# Altium project Face_detectionMac.PrjPCB
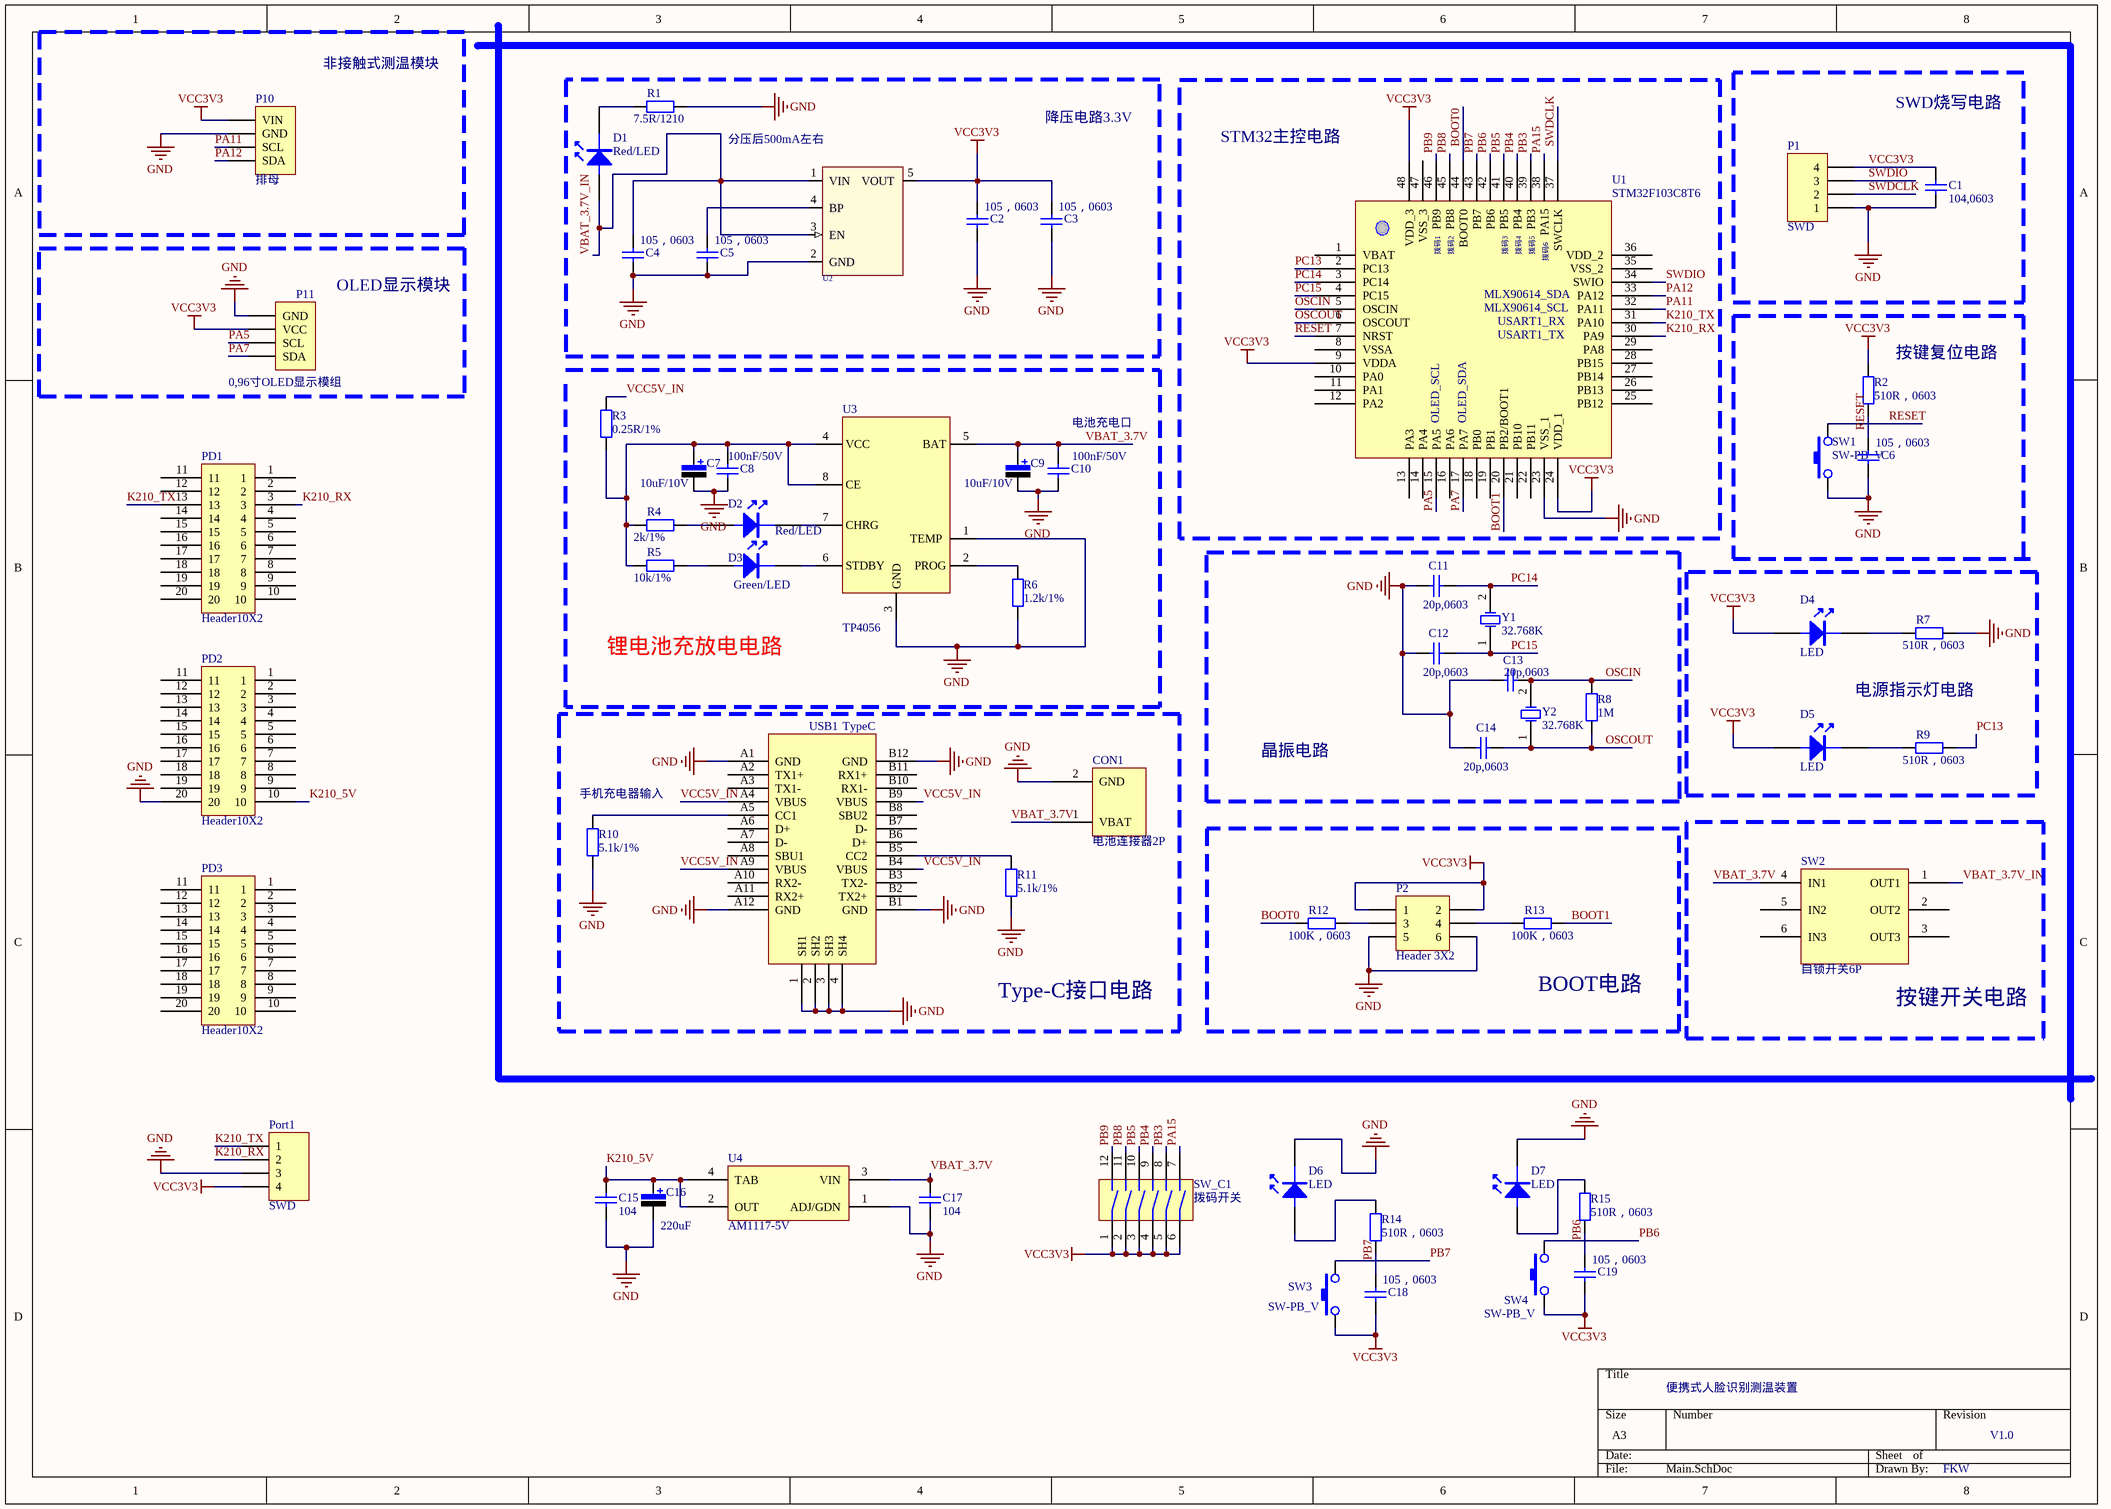
[diagram p0: Main.SchDoc]
1 sheet, 62 parts. Net scope: global (net labels, ports and power ports of the same name join across sheets).
Board file: 便携式人脸识别PCB图.PcbDoc

## Sheet Main.SchDoc
size A3

### Parts
C1  104,0603  [C0603]
C2  105，0603  [C0603]
C3  105，0603  [C0603]
C4  105，0603  [C0603]
C5  105，0603  [C0603]
C6  105，0603  [C0603]
C7  10uF/10V  [C0805tan]
C8  100nF/50V  [C0603]
C9  10uF/10V  [C0805tan]
C10  100nF/50V  [C0603]
C11  20p,0603  [C0603]
C12  20p,0603  [C0603]
C13  20p,0603  [C0603]
C14  20p,0603  [C0603]
C15  104  [C0603]
C16  220uF  [C0805tan]
C17  104  [C0603]
C18  105，0603  [C0603]
C19  105，0603  [C0603]
CON1  电池连接器2P  [CONN-TH_DF1B-2P-2.5DSA-01]
D1  Red/LED  [LED]
D2  Red/LED  [LED]
D3  Green/LED  [LED]
D4  LED  [LED]
D5  LED  [LED]
D6  LED  [LED]
D7  LED  [LED]
P1  SWD  [HDR1X4H]
P2  Header 3X2  [HDR2X3]
P10  排母  [HRD1X4]
P11  0,96寸OLED显示模组  [0.96寸OLED显示模组]
PD1  Header10X2  [header2X10]
PD2  Header10X2  [header2X10]
PD3  Header10X2  [header2X10]
Port1  SWD  [HDR1X4H]
R1  7.5R/1210  [R0603]
R2  510R，0603  [R0603]
R3  0.25R/1%  [R0603]
R4  2k/1%  [R0603]
R5  10k/1%  [R0603]
R6  1.2k/1%  [R0603]
R7  510R，0603  [R0603]
R8  1M  [R0603]
R9  510R，0603  [R0603]
R10  5.1k/1%  [R0603]
R11  5.1k/1%  [R0603]
R12  100K，0603  [R0603]
R13  100K，0603  [R0603]
R14  510R，0603  [R0603]
R15  510R，0603  [R0603]
SW1  SW-PB_V  [轻触开关_TPR_SMD]
SW2  自锁开关6P  [SW_自锁]
SW3  SW-PB_V  [轻触开关_TPR_SMD]
SW4  SW-PB_V  [轻触开关_TPR_SMD]
SW_C1  拨码开关  [6P拨码开关]
U1  STM32F103C8T6  [48P]
U2  RT9193  [SOT-23-5]  (value not drawn)
U3  TP4056  [SOP8-TP4056-3D]
U4  AM1117-5V  [AM1117-5V-SOT-223]
USB1  TypeC  [Type-c]
Y1  32.768K  [SMD2012]
Y2  32.768K  [XTAL1]

### Blocks framed on the sheet
非接触式测温模块: P10
降压电路3.3V: C2-C5 D1 R1 U2
STM32主控电路: U1
SWD烧写电路: C1 P1
OLED显示模块: P11
晶振电路: C11-C14 R8 Y1 Y2
Type-C接口电路: CON1 R10 R11 USB1
按键开关电路: SW2
BOOT电路: P2 R12 R13

### Nets
GND: C1.1 C2.1 C3.1 C4.1 C5.1 C6.1 C7.2 C8.1 C9.2 C10.1 C11.1 C12.1 C13.1 C14.1 C15.1 C16.2 C17.1 CON1.2(GND) D6.K D7.K P1.1 P2.5 P2.6 P10.2(GND) P11.1(GND) PD2.20 Port1.3 R1.1 R6.2 R7.1 R10.2 R11.2 SW1.1 U1.23(VSS_1) U2.2(GND) U3.1(TEMP) U3.3(GND) U4.1(ADJ/GDN) USB1.1(SH1) USB1.2(SH2) USB1.3(SH3) USB1.4(SH4) USB1.A1(GND) USB1.A12(GND) USB1.B1(GND) USB1.B12(GND)
VCC3V3: C1.2 C2.2 C3.2 C18.1 C19.1 D4.A D5.A P1.4 P2.1 P2.2 P10.1(VIN) P11.2(VCC) Port1.4 R2.2 SW3.1 SW4.1 SW_C1.1 SW_C1.2 SW_C1.3 SW_C1.4 SW_C1.5 SW_C1.6 U1.9(VDDA) U1.24(VDD_1) U1.48(VDD_3) U2.5(VOUT)
BOOT0: R12.2 U1.44(BOOT0)
BOOT1: R13.1 U1.20(PB2/BOOT1)
K210_5V: C15.2 C16.1 PD2.10 U4.2(OUT) U4.4(TAB)
K210_RX: PD1.3 Port1.2 U1.30(PA9)
K210_TX: PD1.13 Port1.1 U1.31(PA10)
OSCIN: C13.2 R8.2 U1.5(OSCIN) Y2.2(OSC2)
OSCOUT: C14.2 R8.1 U1.6(OSCOUT) Y2.1(OSC1)
PA5: P11.3(SCL) U1.15(PA5)
PA7: P11.4(SDA) U1.17(PA7)
PA11: P10.3(SCL) U1.32(PA11)
PA12: P10.4(SDA) U1.33(PA12)
PA15: SW_C1.7 U1.38(PA15)
PB3: SW_C1.8 U1.39(PB3)
PB4: SW_C1.9 U1.40(PB4)
PB5: SW_C1.10 U1.41(PB5)
PB6: C19.2 R15.1 SW4.2 U1.42(PB6)
PB7: C18.2 R14.1 SW3.2 U1.43(PB7)
PB8: SW_C1.11 U1.45(PB8)
PB9: SW_C1.12 U1.46(PB9)
PC13: R9.1 U1.2(PC13)
PC14: C11.2 U1.3(PC14) Y1.2(OSC2)
PC15: C12.2 U1.4(PC15) Y1.1(OSC1)
RESET: C6.2 R2.1 SW1.2 U1.7(NRST)
SWDCLK: P1.2 U1.37(SWCLK)
SWDIO: P1.3 U1.34(SWIO)
VBAT_3.7V: C9.1 C10.2 C17.2 CON1.1(VBAT) SW2.4(IN1) U3.5(BAT) U4.3(VIN)
VBAT_3.7V_IN: C4.2 D1.A SW2.1(OUT1) U2.1(VIN) U2.3(EN)
VCC5V_IN: R3.1 USB1.A4(VBUS) USB1.A9(VBUS) USB1.B4(VBUS) USB1.B9(VBUS)
NetC5_2: C5.2 U2.4(BP)
NetC7_1: C7.1 C8.2 R3.2 R4.2 R5.2 U3.4(VCC) U3.8(CE)
NetD1_K: D1.K R1.2
NetD2_A: D2.A R4.1
NetD2_K: D2.K U3.7(CHRG)
NetD3_A: D3.A R5.1
NetD3_K: D3.K U3.6(STDBY)
NetD4_K: D4.K R7.2
NetD5_K: D5.K R9.2
NetD6_A: D6.A R14.2
NetD7_A: D7.A R15.2
NetP2_3: P2.3 R12.1
NetP2_4: P2.4 R13.2
NetR6_1: R6.1 U3.2(PROG)
NetR10_1: R10.1 USB1.A5(CC1)
NetR11_1: R11.1 USB1.B5(CC2)

Not connected (* = marked no-connect by the designer): PD1 1 2 4 5 6 7 8 9 10 11 12 14 15 16 17 18 19 20; PD2 1 2 3 4 5 6 7 8 9 11 12 13 14 15 16 17 18 19; PD3 1 2 3 4 5 6 7 8 9 10 11 12 13 14 15 16 17 18 19 20; SW2 2(OUT2) 3(OUT3) 5(IN2) 6(IN3); U1 1(VBAT) 8(VSSA) 10(PA0) 11(PA1) 12(PA2) 13(PA3) 14(PA4) 16(PA6) 18(PB0) 19(PB1) 21(PB10) 22(PB11) 25(PB12) 26(PB13) 27(PB14) 28(PB15) 29(PA8) 35(VSS_2) 36(VDD_2) 47(VSS_3); USB1 A2(TX1+) A3(TX1-) A6(D+) A7(D-) A8(SBU1) A10(RX2-) A11(RX2+) B2(TX2+) B3(TX2-) B6(D+) B7(D-) B8(SBU2) B10(RX1-) B11(RX1+)

### Notes on the sheet
- 分压后500mA左右
- (near U1) 拨码1
- (near U1) 拨码2
- (near U1) MLX90614_SCL
- (near U1) MLX90614_SDA
- (near U1) 拨码3
- (near U1) 拨码4
- (near U1) 拨码5
- (near U1) 拨码6
- (near U1) USART1_RX
- (near U1) USART1_TX
- (near R2) 按键复位电路
- (near C10) 电池充电口
- (near U1) OLED_SCL
- (near U1) OLED_SDA
- 锂电池充放电电路
- 电源指示灯电路
- (near R10) 手机充电器输入
- 便携式人脸识别测温装置
- V1.0
- FKW

### Library data of the parts
C1-C6 C8 C10-C14 C18 C19 = Cap: Capacitor; Value: 104; Published: 8-Jun-2000; LatestRevisionDate: 17-Jul-2002; LatestRevisionNote: Re-released for DXP Platform.; Publisher: Altium Limited
C7 C9 C16 = Cap_电解电容
C15 C17 = Cap: Capacitor; Published: 8-Jun-2000; LatestRevisionDate: 17-Jul-2002; LatestRevisionNote: Re-released for DXP Platform.; Publisher: Altium Limited; Value: 104
CON1 = BATinput_Connector: 电池（带防呆口）
D1-D7 = LED: pin to pad: A>1 K>2
P1 Port1 = Header 4: Header, 4-Pin; LatestRevisionDate: 17-Jul-2002; LatestRevisionNote: Re-released for DXP Platform.; Publisher: Altium Limited
P2 = Header 3X2: Header, 3-Pin, Dual row; LatestRevisionDate: 17-Jul-2002; LatestRevisionNote: Re-released for DXP Platform.; Publisher: Altium Limited
P10 = MLX90614
R1-R15 = Res2: Resistor; Published: 8-Jun-2000; LatestRevisionDate: 17-Jul-2002; LatestRevisionNote: Re-released for DXP Platform.; Publisher: Altium Limited
SW1 SW3 SW4 = SW-PB_V: SWITCH
SW2 = SW-自锁6P
SW_C1 = 拨码开关6P
U2 = RT9193X_5P: ICA_MFR_NAME: RICHTEK; ICA_PARTNUM: $$2191094$$RT9193-15CU5; Part Number: TMP-13
U3 = TP4056: 锂电池充放电芯片
U4 = AM1117-5V: 低压差线性稳压器
USB1 = USB-Type-C
Y1 Y2 = XTAL: Crystal Oscillator; Published: 8-Jun-2000; LatestRevisionDate: 17-Jul-2002; LatestRevisionNote: Re-released for DXP Platform.; Publisher: Altium Limited